# EAGLE design MiniRS485_RJ45-MySens-v1 (EAGLE 8.5.1)
MAPLE-CUx Large Version
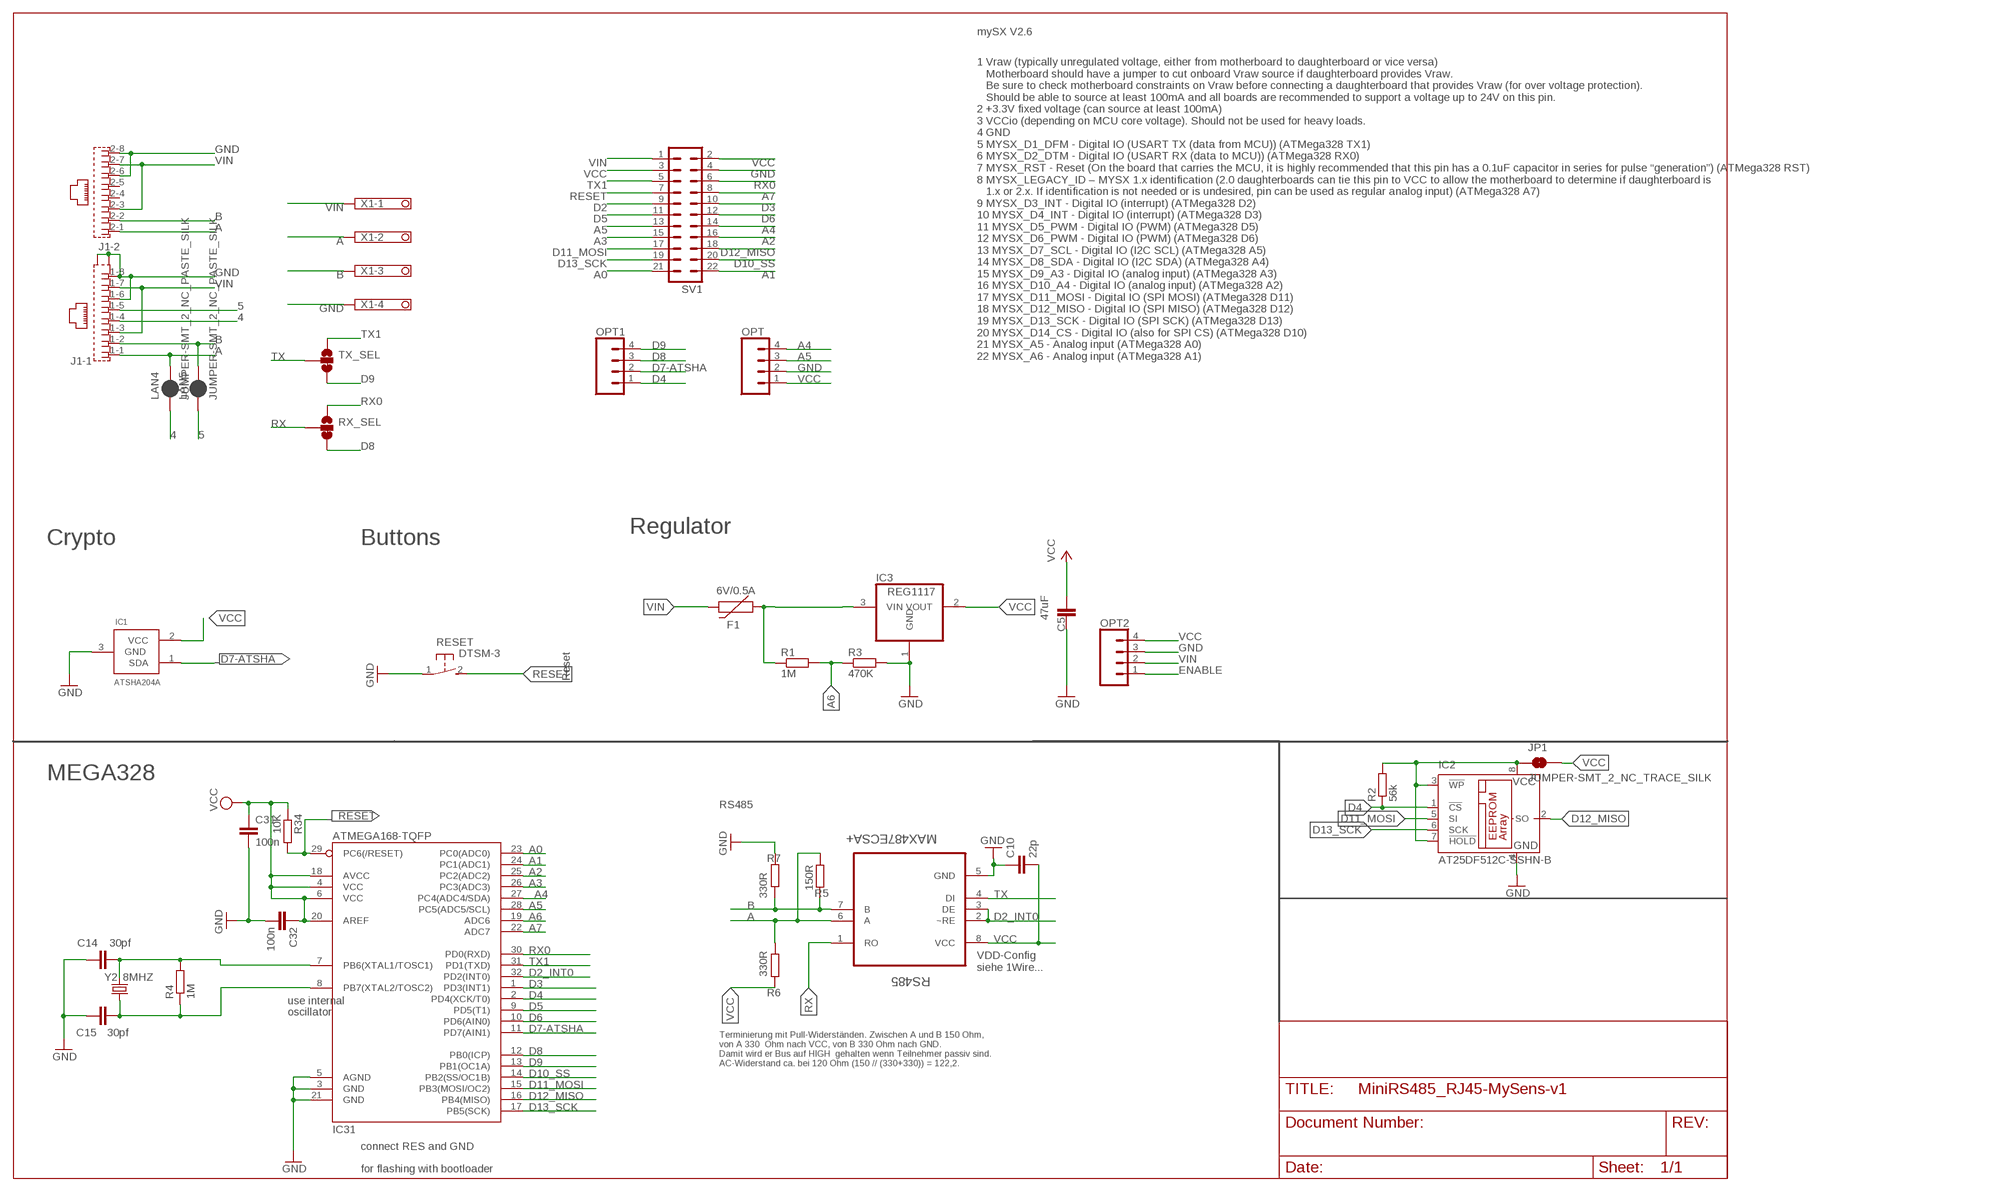
[diagram p0: schematic, sheet 1]

## Parts
C5  47uF  C-EUC1210  [C1210]
C10  22p  C-EUC0805  [C0805]
C14  30pf  C-EUC0805  [C0805]
C15  30pf  C-EUC0805  [C0805]
C31  100n  C-EUC0805  [C0805]
C32  100n  C-EUC0805  [C0805]
F1  6V/0.5A  PPTC_HALF-AMP  [1206]
IC1  ATSHA204A  [SOT23]
IC2  AT25DF512C-SSHN-B  25AA080SN  [SO-08]
IC3  REG1117  [SOT223]
IC31  ATMEGA168-TQFP  [TQFP32-08]
J1  RJ45_2X_NARROW_SHILDPINS_NOCASE  [RJ45_2X_NARROW_SHILDPINS_NOCASE]
JP1  JUMPER-SMT_2_NC_TRACE_SILK  [SMT-JUMPER_2_NC_TRACE_SILK]
LAN4  JUMPER-SMT_2_NC_PASTE_SILK  [SMT-JUMPER_2_NC_PASTE_SILK]
LAN5  JUMPER-SMT_2_NC_PASTE_SILK  [SMT-JUMPER_2_NC_PASTE_SILK]
OPT  CONN_04  [1X04]
OPT1  CONN_04  [1X04]
OPT2  CONN_04  [1X04]
R1  1M  R-EU_M0805  [M0805]
R2  56k  R-EU_M0805  [M0805]
R3  470K  R-EU_R0805  [R0805]
R4  1M  R-EU_M0805  [M0805]
R5  150R  R-EU_R0805  [R0805]
R6  330R  R-EU_R0805  [R0805]
R7  330R  R-EU_R0805  [R0805]
R34  10K  R-EU_R0805  [R0805]
RESET  DTSM-3  [DTSM-3]
RS485  MAX487ECSA+  [SOIC127P600X175-8N]
RX_SEL  JUMPER-SMT_3_1-NC_TRACE_SILK  [SMT-JUMPER_3_1-NC_TRACE_SILK]
SV1  MA11-2  [MA11-2]
TX_SEL  JUMPER-SMT_3_1-NC_TRACE_SILK  [SMT-JUMPER_3_1-NC_TRACE_SILK]
X1  1751264  [1751264]
Y2  8MHZ  CRYSTALTXC-7A  [CRYSTAL-TXC-7A]

## Nets
4: J1.1-4 LAN4.1
5: J1.1-5 LAN5.1
A: J1.1-1 J1.2-1 LAN4.2 R5.1 R6.2 RS485.6(A) X1.2
A0: IC31.23(PC0(ADC0)) SV1.21
A1: IC31.24(PC1(ADC1)) SV1.22
A2: IC31.25(PC2(ADC2)) SV1.16
A3: IC31.26(PC3(ADC3)) SV1.15
A4: IC31.27(PC4(ADC4/SDA)) OPT.4 SV1.14
A5: IC31.28(PC5(ADC5/SCL)) OPT.3 SV1.13
A6: IC31.19(ADC6) R1.2 R3.1
A7: IC31.22(ADC7) SV1.8
B: J1.1-2 J1.2-2 LAN5.2 R5.2 R7.1 RS485.7(B) X1.3
D2: SV1.9
D2_INT0: IC31.32(PD2(INT0)) RS485.2(~RE) RS485.3(DE)
D3: IC31.1(PD3(INT1)) SV1.10
D4: IC2.1(!CS) IC31.2(PD4(XCK/T0)) OPT1.1 R2.1
D5: IC31.9(PD5(T1)) SV1.11
D6: IC31.10(PD6(AIN0)) SV1.12
D7-ATSHA: IC1.1(SDA) IC31.11(PD7(AIN1)) OPT1.2
D8: IC31.12(PB0(ICP)) OPT1.3 RX_SEL.3
D9: IC31.13(PB1(OC1A)) OPT1.4 TX_SEL.3
D10_SS: IC31.14(PB2(SS/OC1B)) SV1.20
D11_MOSI: IC2.5(SI) IC31.15(PB3(MOSI/OC2)) SV1.17
D12_MISO: IC2.2(SO) IC31.16(PB4(MISO)) SV1.18
D13_SCK: IC2.6(SCK) IC31.17(PB5(SCK)) SV1.19
ENABLE: OPT2.1
GND [PWR]: C5.1 C10.1 C14.1 C15.1 C31.2 C32.2 IC1.3(GND) IC2.4(GND) IC3.1(GND) IC31.3(GND) IC31.5(AGND) IC31.21(GND) J1.1-6 J1.1-8 J1.2-6 J1.2-8 J1.G1(-1:S1) J1.G3(-1:S2) OPT2.3 OPT.2 R3.2 R7.2 RESET.1 RS485.5(GND) SV1.4 X1.4
N$3: C14.2 IC31.7(PB6(XTAL1/TOSC1)) R4.2 Y2.P$2
N$19: C15.2 IC31.8(PB7(XTAL2/TOSC2)) R4.1 Y2.P$1
RESET: IC31.29(PC6(/RESET)) R34.2 RESET.2 SV1.7
RX: RS485.1(RO) RX_SEL.2
RX0: IC31.30(PD0(RXD)) RX_SEL.1 SV1.6
TX: RS485.4(DI) TX_SEL.2
TX1: IC31.31(PD1(TXD)) SV1.5 TX_SEL.1
VCC [PWR]: C5.2 C10.2 C31.1 C32.1 IC1.2(VCC) IC3.2(VOUT) IC31.4(VCC) IC31.6(VCC) IC31.18(AVCC) IC31.20(AREF) JP1.2 OPT2.4 OPT.1 R6.1 R34.1 RS485.8(VCC) SV1.2 SV1.3
VCC1 [PWR]: IC2.3(!WP) IC2.7(!HOLD) IC2.8(VCC) JP1.1 R2.2
VIN [PWR]: F1.2 J1.1-3 J1.1-7 J1.2-3 J1.2-7 OPT2.2 SV1.1 X1.1
VIN-FUSED [PWR]: F1.1 IC3.3(VIN) R1.1
Unconnected: J1.2-4 J1.2-5

## Notes on the sheet
- mySX V2.6
- 1 Vraw (typically unregulated voltage, either from motherboard to daughterboard or vice versa)
     Motherboard should have a jumper to cut onboard Vraw source if daughterboard provides Vraw. 
     Be sure to check motherboard constraints on Vraw before connecting a daughterboard that provides Vraw (for over voltage protection). 
     Should be able to source at least 100mA and all boards are recommended to support a voltage up to 24V on this pin.
  2 +3.3V fixed voltage (can source at least 100mA)
  3 VCCio (depending on MCU core voltage). Should not be used for heavy loads.
  4 GND
  5 MYSX_D1_DFM - Digital IO (USART TX (data from MCU)) (ATMega328 TX1)
  6 MYSX_D2_DTM - Digital IO (USART RX (data to MCU)) (ATMega328 RX0)
  7 MYSX_RST - Reset (On the board that carries the MCU, it is highly recommended that this pin has a 0.1uF capacitor in series for pulse “generation”) (ATMega328 RST)
  8 MYSX_LEGACY_ID – MYSX 1.x identification (2.0 daughterboards can tie this pin to VCC to allow the motherboard to determine if daughterboard is 
     1.x or 2.x. If identification is not needed or is undesired, pin can be used as regular analog input) (ATMega328 A7)
  9 MYSX_D3_INT - Digital IO (interrupt) (ATMega328 D2)
  10 MYSX_D4_INT - Digital IO (interrupt) (ATMega328 D3)
  11 MYSX_D5_PWM - Digital IO (PWM) (ATMega328 D5)
  12 MYSX_D6_PWM - Digital IO (PWM) (ATMega328 D6)
  13 MYSX_D7_SCL - Digital IO (I2C SCL) (ATMega328 A5)
  14 MYSX_D8_SDA - Digital IO (I2C SDA) (ATMega328 A4)
  15 MYSX_D9_A3 - Digital IO (analog input) (ATMega328 A3)
  16 MYSX_D10_A4 - Digital IO (analog input) (ATMega328 A2)
  17 MYSX_D11_MOSI - Digital IO (SPI MOSI) (ATMega328 D11)
  18 MYSX_D12_MISO - Digital IO (SPI MISO) (ATMega328 D12)
  19 MYSX_D13_SCK - Digital IO (SPI SCK) (ATMega328 D13)
  20 MYSX_D14_CS - Digital IO (also for SPI CS) (ATMega328 D10)
  21 MYSX_A5 - Analog input (ATMega328 A0)
  22 MYSX_A6 - Analog input (ATMega328 A1)
- Regulator
- Crypto | Buttons
- Reset
- MEGA328
- RS485
- VDD-Config
  siehe 1Wire...
- use internal
- oscillator
- Terminierung mit Pull-Widerständen. Zwischen A und B 150 Ohm,
  von A 330  Ohm nach VCC, von B 330 Ohm nach GND. 
  Damit wird er Bus auf HIGH  gehalten wenn Teilnehmer passiv sind.
  AC-Widerstand ca. bei 120 Ohm (150 // (330+330)) = 122,2.
- connect RES and GND
- for flashing with bootloader

## Library data of the parts
C5 C10 C31 C32 = rcl:C-EU: CAPACITOR, European symbol; SPICEPREFIX: C
C14 C15 = resistor:C-EU: CAPACITOR, European symbol
F1 = SparkFun-Fuses:PPTC: Resettable Fuse PPTC Resettable Fuse. Really a sort of resistor with a polymeric positive temperature coefficient whose resistance increases dramatically with an increase in temperature. When heated by the power passing through the resistance rises causing the current to be limited, protecting the circuit. This is achieved by the transition of the polymer from a crystalline to an amorphous state where the conductive carbon separates breaking the conductive pathways found in the cool crystalline structure. When a PPTC cools back down it resumes conducting letting the circuit turn back on. SparkFun Products: SparkFun RedBoard - Programmed with Arduino <https://www.sparkfun.com/products/12757> Pro Micro - 5V/16MHz <https://www.sparkfun.com/products/12640> Arduino Pro 328 - 5V/16MHz <https://www.sparkfun.com/products/10915> MP3 Trigger <https://www.sparkfun.com/products/13720>; PROD_ID: RES-08585
IC1 = Sensor:ATSHA204A
IC2 = microchip:25*: Serial EEPROM 4K/ 8K , SPI bus; MF: MICROCHIP; MPN: 25AA080/SN; OC_FARNELL: 1816072; OC_NEWARK: 92C7351
IC3 = burr-brown:REG1117: 800mA and 1A Low Dropout (LDO) Positive Regulator 1.8V, 2.5V, 2.85V, 3.3V, 5V, and Adj; MPN: REG1117; OC_FARNELL: 1097566; OC_NEWARK: 14P6981
IC31 = atmel:ATMEGA168: Atmel Atmega 168/328/328P
J1 = RJ45:RJ45_2X_NARROW_SHILDPINS_NOCASE: RJ45 connector
JP1 = SparkFun-Jumpers:JUMPER-SMT_2_NC_TRACE: Normally closed trace jumper This jumper has a trace between two pads so it's normally closed (NC). Use a razor knife to open the connection. For best results follow the IPC guidelines for cutting traces: Cutout at least 0.063 mm (0.005 in). Remove all loose material to clean up the cut area. Seal the cut with an approved epoxy. Reapply solder to reclose the connection.
LAN4 LAN5 = SparkFun-Jumpers:JUMPER-SMT_2_NC_PASTE: Normally closed solder jumper This jumper has an aperture in the stencil to allow solder paste to bridge the split in the wire so it's normally closed (NC). Wick off the solder to open the connection. Reapply solder to reclose the connection.
OPT OPT1 OPT2 = SparkFun-Connectors:CONN_04: Multi connection point. Often used as Generic Header-pin footprint for 0.1 inch spaced/style header connections On any of the 0.1 inch spaced packages, you can populate with these: Break Away Headers - Straight <https://www.sparkfun.com/products/116> (PRT-00116) Break Away Male Headers - Right Angle <https://www.sparkfun.com/products/553> (PRT-00553) Female Headers <https://www.sparkfun.com/products/115> (PRT-00115) Break Away Headers - Machine Pin <https://www.sparkfun.com/products/117> (PRT-00117) Break Away Female Headers - Swiss Machine Pin <https://www.sparkfun.com/products/743> (PRT-00743) For SCREWTERMINALS and SPRING TERMINALS visit here: Screw Terimnals on SparkFun.com <https://www.sparkfun.com/search/results?term=Screw+Terminals> (5mm/3.5mm/2.54mm spacing) This device is also useful as a general connection point to wire up your design to another part of your project. Our various solder wires solder well into these plated through hole pads. Hook-Up Wire - Assortment (Stranded, 22 AWG) <https://www.sparkfun.com/products/11375> (PRT-11375) Hook-Up Wire - Assortment (Solid Core, 22 AWG) <https://www.sparkfun.com/products/11367> (PRT-11367) View the entire wire category on our website here <https://www.sparkfun.com/categories/141> Special notes: Molex polarized connector foot print use with SKU : PRT-08231 with associated crimp pins and housings. 1MM SMD Version SKU: PRT-10208; PROD_ID: CONN-09696
R1 R3-R7 R34 = rcl:R-EU_: RESISTOR, European symbol; SPICEPREFIX: R
R2 = resistor:R-EU_: RESISTOR, European symbol
RESET = mechanics:DTSM-3: Diptronics SMD button 6x3.5 mm
RS485 = Maxim_By_element14_Batch_1:MAX487ECSA+: Low-Power, Slew-Rate-Limited RS-485/RS-422 Transceivers; MPN: MAX487ECSA+; OC_FARNELL: 9724532; OC_NEWARK: 68K4803; PACKAGE: SOIC-8; SUPPLIER: Maxim
RX_SEL TX_SEL = SparkFun-Jumpers:JUMPER-SMT_3_1-NC_TRACE: Normally closed trace jumper (1 of 2 connections) This jumper has a trace between two pads so it's normally closed (NC). The other connection is normally open (NO). Use a razor knife to open the connection. For best results follow the IPC guidelines for cutting traces: Cutout at least 0.063 mm (0.005 in). Remove all loose material to clean up the cut area. Seal the cut with an approved epoxy. Reapply solder to reclose the connection, or to close the NO connection.
SV1 = con-Pinheader:MA11-2: PIN HEADER; OC_FARNELL: unknown; OC_NEWARK: unknown
X1 = con-phoenix-350:1751264: MKDS 1/ 4-3,5 Printklemme Nennstrom: 10 A Bemessungsspannung: 160 V Raster: 3,5 mm Polzahl: 4 Montageart: Löten Anschlussart: Schraubanschluss Anschlussrichtung vom Leiter zur Platine: 0° Source: http://eshop.phoenixcontact.com .. 1751264.pdf; MPN: 1751264; OC_FARNELL: unknown; OC_NEWARK: 10R0934
Y2 = SparkFun-FreqCtrl:CRYSTAL: Various standard crystals. Proven footprints.

## Net classes
0 default: width 0.254 mm, clearance 0.205 mm
1 PWR: width 0.406 mm, clearance 0.205 mm to class 0, clearance 0.205 mm

## Board
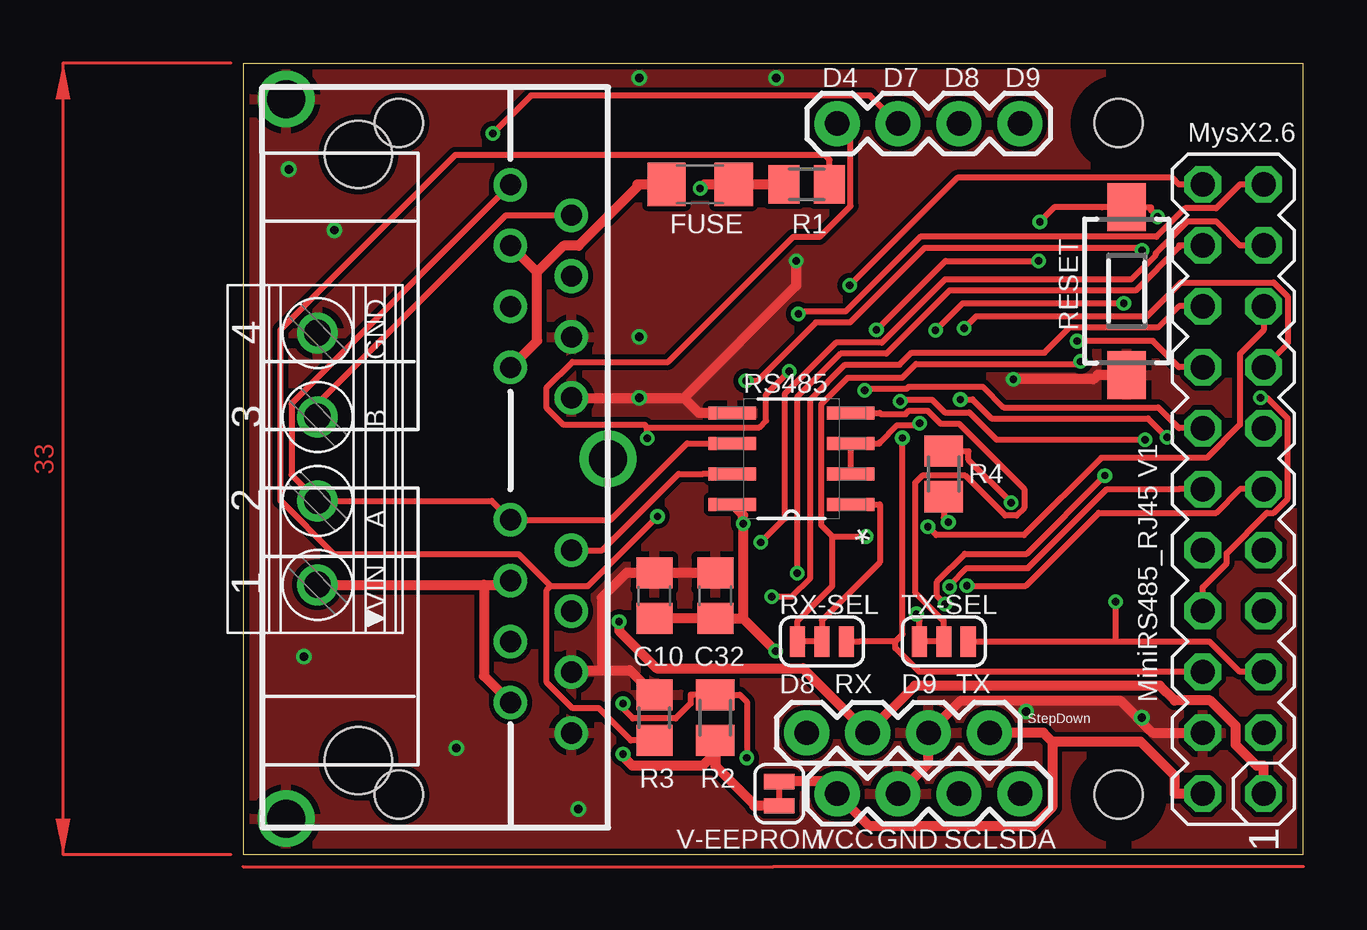
[diagram p1: board, top side]
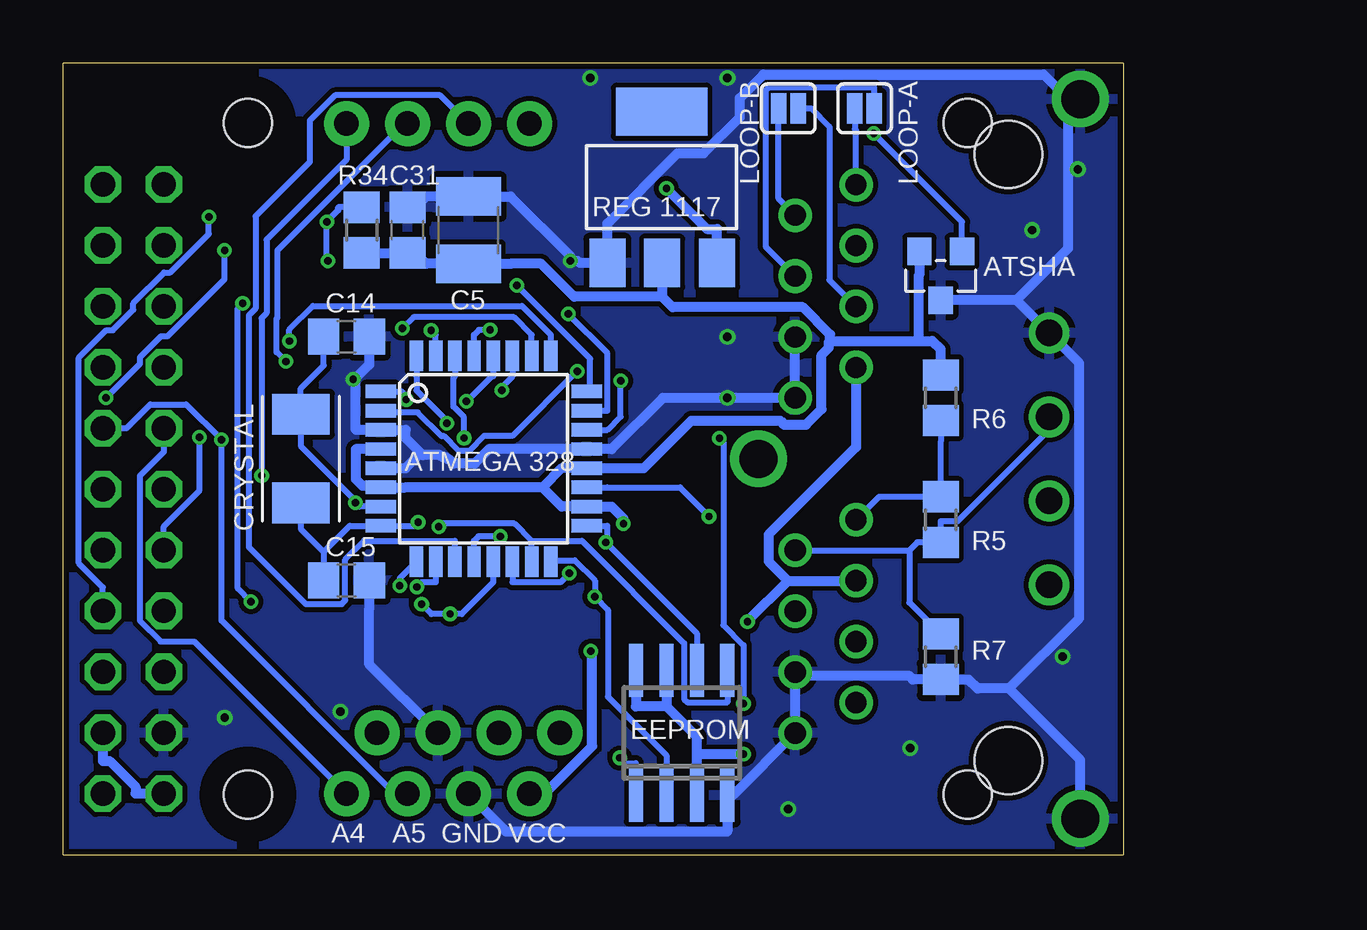
[diagram p2: board, bottom side, seen from below]

Size 44.2 x 33 mm. Coordinates in mm from the lower left corner, seen from the top.
Outline: 44.2,0 0,0 0,33 44.2,33 44.2,0
Copper layers (1*16): Top 0.035mm / dielectric 1.5mm / Bottom 0.035mm
Design rules "SeeedStudio_2layer_DRU_no_angle_20140221 *": minimum track width 6mil, minimum drill 12mil, track to track 4mil, track to pad 4mil, pad to pad 4mil, via to via 4mil, smd to smd 0mil, copper to edge 10mil, drill to drill 10mil, minimum pad ring 10mil, minimum via ring 6mil, stop-mask expansion 2mil, vias tented up to drill 100mil, thermal gap 10mil
Holes 2 mm at 36.5,30.5 36.5,2.5 6.5,2.5 6.5,30.5
tRestrict: area 34.8,0.8 to 38.2,4.2; area 34.8,28.8 to 38.2,32.2
bRestrict: area 34.8,28.8 to 38.2,32.2; area 34.8,0.8 to 38.2,4.2

### Footprints (pad centres in the part's own frame; a part is rotated, then mirrored left to right if it is on the bottom)
C1210 = smd 1.6 x 2.7: 1 -1.4,0; 2 1.4,0
C0805 = smd 1.3 x 1.5: 1 -0.95,0; 2 0.95,0
1206 = smd 1.6 x 1.8: 1 -1.4,0; 2 1.4,0
SOT23 = smd 1.016 x 1.143: 1 -0.889,-1.016; 2 0.889,-1.016; 3 0,1.016
SO-08 = smd 0.6 x 2.2: 1 -1.905,-2.6; 2 -0.635,-2.6; 3 0.635,-2.6; 4 1.905,-2.6; 5 1.905,2.6; 6 0.635,2.6; 7 -0.635,2.6; 8 -1.905,2.6
SOT223 = smd 1.499 x 2.007: 1 -2.261,-3.15; 2 0.025,-3.15; 3 2.311,-3.15 | smd 3.81 x 2.007: 4 0,3.15
TQFP32-08 = smd 1.27 x 0.559: 1 -4.293,2.8; 2 -4.293,2; 3 -4.293,1.2; 4 -4.293,0.4; 5 -4.293,-0.4; 6 -4.293,-1.2; 7 -4.293,-2; 8 -4.293,-2.8; 17 4.293,-2.8; 18 4.293,-2; 19 4.293,-1.2; 20 4.293,-0.4; 21 4.293,0.4; 22 4.293,1.2; 23 4.293,2; 24 4.293,2.8 | smd 0.559 x 1.27: 9 -2.8,-4.293; 10 -2,-4.293; 11 -1.2,-4.293; 12 -0.4,-4.293; 13 0.4,-4.293; 14 1.2,-4.293; 15 2,-4.293; 16 2.8,-4.293; 25 2.8,4.293; 26 2,4.293; 27 1.2,4.293; 28 0.4,4.293; 29 -0.4,4.293; 30 -1.2,4.293; 31 -2,4.293; 32 -2.8,4.293
RJ45_2X_NARROW_SHILDPINS_NOCASE = drill 0.889: 1-1 -11.43,6.35; 1-2 -10.16,8.89; 1-3 -8.89,6.35; 1-4 -7.62,8.89; 1-5 -6.35,6.35; 1-6 -5.08,8.89; 1-7 -3.81,6.35; 1-8 -2.54,8.89; 2-1 2.54,6.35; 2-2 3.81,8.89; 2-3 5.08,6.35; 2-4 6.35,8.89; 2-5 7.62,6.35; 2-6 8.89,8.89; 2-7 10.16,6.35; 2-8 11.43,8.89 | drill 1.575 pad 2.184: G1 -15,-3; G2 0,10.414; G3 15,-3 | hole 2.8: -12.7,0; 12.573,0
SMT-JUMPER_2_NC_TRACE_SILK = smd 0.635 x 1.27: 1 -0.508,0; 2 0.508,0
SMT-JUMPER_2_NC_PASTE_SILK = smd 0.635 x 1.27: 1 -0.406,0; 2 0.406,0
1X04 = drill 1.016 pad 1.88: 1 0,0; 2 2.54,0; 3 5.08,0; 4 7.62,0
M0805 = smd 1.3 x 1.6: 1 -0.95,0; 2 0.95,0
R0805 = smd 1.3 x 1.5: 1 -0.95,0; 2 0.95,0
DTSM-3 = smd 2 x 1.6: 1 -3.494,0; 2 3.494,0
SOIC127P600X175-8N = smd 1.981 x 0.533: 1 -2.464,1.905; 2 -2.464,0.635; 3 -2.464,-0.635; 4 -2.464,-1.905; 5 2.464,-1.905; 6 2.464,-0.635; 7 2.464,0.635; 8 2.464,1.905
SMT-JUMPER_3_1-NC_TRACE_SILK = smd 0.635 x 1.27: 1 -1.016,0; 2 0,0; 3 1.016,0
MA11-2 = drill 1.016 octagon: 1 -12.7,-1.27; 2 -12.7,1.27; 3 -10.16,-1.27; 4 -10.16,1.27; 5 -7.62,-1.27; 6 -7.62,1.27; 7 -5.08,-1.27; 8 -5.08,1.27; 9 -2.54,-1.27; 10 -2.54,1.27; 11 0,-1.27; 12 0,1.27; 13 2.54,-1.27; 14 2.54,1.27; 15 5.08,-1.27; 16 5.08,1.27; 17 7.62,-1.27; 18 7.62,1.27; 19 10.16,-1.27; 20 10.16,1.27; 21 12.7,-1.27; 22 12.7,1.27
1751264 = drill 1.1 pad 1.7: 1 -5.25,-0.1; 2 -1.75,-0.1; 3 1.75,-0.1; 4 5.25,-0.1
CRYSTAL-TXC-7A = smd 1.7 x 2.4: P$1 1.85,0; P$2 -1.85,0

### Placement (x,y rotation side)
C5  27.3,26.04 270 bottom
C10  17.14,10.79 270 top
C14  32.38,21.59 180 bottom
C15  32.38,11.43 180 bottom
C31  29.84,26.04 90 bottom
C32  19.68,10.79 90 top
F1  19.05,27.94 180 top
IC1  7.62,24.13 180 bottom
IC2  18.41,5.08 0 bottom
IC3  19.25,27.82 0 bottom
IC31  26.67,16.51 0 bottom
J1  4.8,16.5 270 top
JP1  22.35,2.54 90 top
LAN4  10.79,31.11 180 bottom
LAN5  13.97,31.11 180 bottom
OPT  24.77,2.54 0 top
OPT1  24.77,30.48 0 top
OPT2  23.5,5.08 0 top
R1  23.5,27.94 0 top
R2  19.68,5.71 270 top
R3  17.14,5.71 90 top
R4  29.21,15.88 90 top
R5  7.62,13.97 270 bottom
R6  7.62,19.05 270 bottom
R7  7.62,8.26 270 bottom
R34  31.75,26.04 90 bottom
RESET  36.83,23.5 90 top
RS485  22.86,16.51 180 top
RX_SEL  24.13,8.89 180 top
SV1  41.27,15.24 90 top
TX_SEL  29.21,8.89 180 top
X1  3,16.5 90 top
Y2  34.29,16.51 270 bottom

### Tracks (layer width: path | path; a pad name or v marks a point on that pad's centre or on a via)
4
  Bottom 0.254: LAN4.1 10.39,31.98 14.79,31.98 14.92,31.85 14.92,25.35 J1.1-4
5
  Bottom 0.254: LAN5.1 13.02,31.11 12.26,30.36 12.26,23.96 J1.1-5
A
  Top 0.254: J1.1-1 2.02,18.8 2.02,15.83 X1.2 10.36,14.75 J1.2-1 15.32,13.96 18.51,17.14 RS485.6
  Bottom 0.254: LAN4.2 11.2,30.25 11.15,30.2 J1.1-1 | R6.2 7.62,17.22 R5.1 10.19,14.92 J1.2-1
A0  (via drill 0.3 pad 0.61)
  Top 0.254: v23.15,22.54 23.25,22.64 25.11,22.64 28.23,25.76 38.07,25.76 39.26,26.95 40.56,26.95 41.55,27.94 SV1.21
  Bottom 0.254: v23.15,22.54 21.51,20.91 21.51,18.51 IC31.23
A1  (via drill 0.3 pad 0.61)
  Top 0.254: v25.28,23.73 29.77,28.22 38.74,28.22 39.01,27.94 SV1.22
  Bottom 0.254: IC31.24 22.23,19.45 22.23,20.68 v25.28,23.73
A2  (via drill 0.3 pad 0.61)
  Top 0.254: SV1.16 39.01,20.32 37.92,21.41 v34.77,21.41
  Bottom 0.254: IC31.25 23.87,21.67 25.08,22.87 33.78,22.87 34.77,21.89 v34.77,21.41
A3  (via drill 0.3 pad 0.61)
  Top 0.254: v30.06,21.95 30.56,22.45 37.69,22.45 39.1,23.86 42.95,23.86 43.54,23.27 43.54,21.32 SV1.15
  Bottom 0.254: v30.06,21.95 29.6,22.41 25.41,22.41 24.67,21.67 IC31.26
A4  (via drill 0.3 pad 0.61)
  Top 0.254: v25.91,19.36 25.98,19.43 27.67,19.43 27.75,19.51 30.84,19.51 31.7,18.65 38.15,18.65 39.01,17.78 SV1.14
  Bottom 0.254: v25.91,19.36 25.91,19.5 25.47,19.94 IC31.27 | SV1.14 40.01,16.79 41,15.8 41,9.75 40.14,8.89 38.73,8.89 OPT.4
A5  (via drill 0.3 pad 0.61)
  Top 0.254: v27.39,18.9 27.46,18.97 28.72,18.97 29.25,18.44 30.27,18.44 31.41,17.3 v37.6,17.3
  Bottom 0.254: SV1.13 41.55,17.78 40.56,18.77 39.07,18.77 v37.6,17.3 37.6,9.77 30.37,2.54 OPT.3 | v27.39,18.9 26.35,19.94 26.27,19.94 IC31.28
A6  (via drill 0.3 pad 0.61)
  Top 0.254: 12.82,11.2 11.5,12.53 3.8,12.53 1.56,14.76 1.56,21.88 8.85,29.17 24.24,29.17 24.45,28.97 R1.2 | 12.82,11.2 12.66,11.04 12.66,7.18 13.74,6.1 14.83,6.1 16.17,4.76 R3.1 | 12.82,11.2 14.38,11.2 v17.28,14.1
  Bottom 0.254: v17.28,14.1 18.48,15.31 21.51,15.31 IC31.19
A7  (via drill 0.3 pad 0.61)
  Top 0.254: v37.47,25.2 37.38,25.29 28.4,25.29 25.3,22.18 23.88,22.18 21.45,19.75 v20.96,19.75 | v42.41,19.05 42.68,19.05 43.54,18.19 43.54,14.83 42.95,14.25 42.68,14.25 41,12.56 41,12.14 40.01,11.15 SV1.8
  Bottom 0.254: v42.41,19.05 41,20.46 41,20.74 40.12,21.61 39.85,21.61 37.47,23.99 v37.47,25.2 | v20.96,19.75 20.96,18.26 21.51,17.71 IC31.22
B
  Top 0.254: J1.2-2 14.97,12.69 18.15,15.88 19.18,15.88 RS485.7 | X1.3 3.1,18.81 10.95,26.66 J1.1-2
  Bottom 0.254: X1.3 3.1,17.71 6.92,13.9 7.62,13.9 R5.2 8.6,13.02 8.93,12.69 | 8.93,12.69 8.93,10.51 R7.1 | J1.2-2 8.93,12.69 | J1.1-2 14.38,27.35 LAN5.2
D2_INT0  (via drill 0.3 pad 0.61)
  Top 0.254: v28.2,17.98 28.12,17.9 27.26,17.9 26.54,17.19 26.54,17.14 RS485.3 RS485.2
  Bottom 0.254: v28.2,17.98 28.2,18.09 29.47,19.36 29.47,19.94 IC31.32
D3  (via drill 0.3 pad 0.61)
  Top 0.254: v29.9,18.98 30.41,18.98 31.19,18.19 37.72,18.19 v38.51,17.4
  Bottom 0.254: v38.51,17.4 38.51,15.18 40.01,13.69 SV1.10 | v29.9,18.98 29.9,19.11 30.1,19.31 IC31.1
D4  (via drill 0.3 pad 0.61)
  Top 0.254: 16.84,17.81 21.52,17.81 21.8,18.09 21.8,19.18 v22.77,20.15 | v16.84,17.36 16.84,17.81 | 16.84,17.81 16.75,17.91 13.36,17.91 12.66,18.61 12.66,19.47 13.72,20.54 17.72,20.54 22.94,25.76 24.04,25.76 25.33,27.04 25.33,29.92 OPT1.1 | v21,4.04 21,6.38 20.71,6.67 R2.1 19.17,6.67 18.66,6.67 18.66,6.31 18.03,5.68 16.25,5.68 15.84,6.09 v15.84,6.3
  Bottom 0.254: v16.84,17.36 16.68,17.19 16.68,9.57 15.84,8.73 v15.84,6.3 | IC2.1 20.32,3.81 20.77,3.81 v21,4.04 | v22.77,20.15 25.47,17.46 26.65,17.46 27.27,16.84 27.71,16.84 28.32,17.45 28.42,17.45 29.42,18.44 30.89,18.44 IC31.2
D5  (via drill 0.3 pad 0.61)
  Top 0.254: v30.17,11.21 32.63,11.21 35.66,14.25 40.56,14.25 41.55,15.24 SV1.11
  Bottom 0.254: IC31.9 30.17,11.52 v30.17,11.21
D6  (via drill 0.3 pad 0.61)
  Top 0.254: v29.46,11.16 29.46,11.25 30.16,11.95 32.72,11.95 36.01,15.24 39.01,15.24 SV1.12
  Bottom 0.254: v29.46,11.16 29.27,11.35 28.67,11.35 IC31.10
D7-ATSHA  (via drill 0.3 pad 0.61)
  Top 0.254: OPT1.2 26.14,31.65 12,31.65 v10.41,30.06
  Bottom 0.254: IC1.1 6.73,26.39 v10.41,30.06 | OPT1.2 28.48,31.65 32.87,31.65 33.91,30.6 33.91,28.88 36.18,26.61 36.18,22.76 36.46,22.48 36.46,12.82 34.09,10.45 32.59,10.45 32.44,10.6 32.44,12.3 31.66,13.08 27.87,13.08 IC31.11
D8  (via drill 0.3 pad 0.61)
  Top 0.254: 24.56,13.27 24.1,13.73 24.1,18.78 25.21,19.89 27.48,19.89 28.05,20.46 34.82,20.46 v34.92,20.56 | 24.56,13.27 24.56,11.2 23.11,9.75 RX_SEL.3 | 24.56,13.27 v25.97,13.27
  Bottom 0.254: v34.92,20.56 35.3,20.94 35.3,22.34 35.26,22.38 35.26,25.2 29.98,30.48 OPT1.3 | IC31.12 27.07,13.08 26.88,13.27 v25.97,13.27
D9  (via drill 0.3 pad 0.61)
  Top 0.254: v29.26,10.45 28.92,10.78 28.92,11.38 30.08,12.54 32.67,12.54 v35.92,15.8 | TX_SEL.3 28.19,9.75 28.07,9.88 v28.07,10.04
  Bottom 0.254: OPT1.4 32.38,28.97 35.72,25.64 35.72,22.57 35.92,22.37 v35.92,15.8 | v29.26,10.45 28.85,10.04 v28.07,10.04 27.59,10.04 26.27,11.35 IC31.13
D10_SS  (via drill 0.3 pad 0.61)
  Top 0.254: 29.45,23.52 37.21,23.52 39.01,25.32 39.01,25.4 SV1.20 | 29.45,23.52 | 29.45,23.52 26.81,20.88 24.9,20.88 23.1,19.07 v23.1,11.73
  Bottom 0.254: IC31.14 25.47,11.35 23.48,11.35 v23.1,11.73
D11_MOSI  (via drill 0.3 pad 0.61)
  Top 0.254: v28.55,13.68 28.9,13.32 32.55,13.32 35.77,16.54 40.17,16.54 41.55,17.93 41.55,20.88 42.55,21.87 SV1.17
  Bottom 0.254: 24.67,13.08 25.39,13.8 28.42,13.8 v28.55,13.68 | IC2.5 16.51,6.35 18.18,6.35 18.31,6.48 18.31,8.82 22.57,13.08 24.67,13.08 | 24.67,13.08 24.67,12.97 IC31.15
D12_MISO  (via drill 0.3 pad 0.61)
  Top 0.254: v22.04,10.76 22.88,10.76 23.64,11.52 23.64,18.97 25.09,20.42 27.36,20.42 27.86,20.92 33.41,20.92 34.47,21.99 38.14,21.99 39.01,22.86 SV1.18
  Bottom 0.254: IC2.2 19.05,4.14 21.49,6.58 21.49,10.21 v22.04,10.76 22.04,11.43 22.87,12.27 23.82,12.27 IC31.16
D13_SCK  (via drill 0.3 pad 0.61)
  Top 0.254: 26.62,21.34 29.26,23.98 37.01,23.98 38.04,25 38.04,25.08 39.35,26.39 40.56,26.39 41.55,25.4 SV1.19 | 26.62,21.34 | 26.62,21.34 24.71,21.34 22.57,19.2 22.57,14.01 v21.57,13.02
  Bottom 0.254: IC31.17 21.51,13.71 21.51,13.08 v21.57,13.02 17.78,9.22 IC2.6
GND  (via drill 0.3 pad 0.61, 0.35)
  Top 0.406: 14.96,7.69 16.12,7.69 R3.2 | J1.2-6 13.77,7.69 14.96,7.69 | 14.96,7.69 14.96,10.72 15.99,11.74 C10.1 C32.2 | v32.11,19.82 35.44,19.82 35.62,20 RESET.1 | 18.37,19.04 19,18.41 RS485.5 | J1.1-8 18.37,19.04 | v23.06,24.75 23.06,23.72 18.37,19.04 | SV1.4 37.91,5.08 36.56,6.43 29.92,6.43 OPT2.3 28.57,3.81 OPT.2
  Bottom 0.406: 29.29,16.74 29.21,16.66 28.47,16.66 28.38,16.57 28.25,16.57 28.17,16.49 28.11,16.49 27.93,16.3 27.04,16.3 26.44,16.91 23.42,16.91 IC31.21 21.33,16.91 19.2,19.04 J1.1-8 J1.1-6 | OPT.2 25.74,0.97 16.51,0.97 IC2.4 16.28,2.48 J1.2-8 13.69,7.45 | 2.31,31.5 J1.G1 | 2.31,31.5 3.33,32.52 15.01,32.52 16,31.54 16,30.74 17.5,29.24 18.59,29.24 21.52,26.32 IC3.1 22.67,24.67 22.76,24.75 v23.06,24.75 23.06,24.94 25.55,27.43 C5.1 29.06,27.43 29.51,26.98 C31.2 | 2.31,31.5 2.31,25.27 4.46,23.11 | 4.46,23.11 IC1.3 | 4.46,23.11 X1.4 1.84,20.49 1.84,9.86 4.77,6.92 | 32.01,19.82 32.01,19.86 31.43,20.43 C14.1 | 32.01,19.82 32.01,17.71 IC31.3 29.92,17.71 29.92,17.36 29.29,16.74 | 32.01,19.82 v32.11,19.82 | 29.29,16.74 29.92,16.11 IC31.5 | OPT2.3 31.43,7.94 31.43,10.27 C15.1 | 13.69,7.45 J1.2-6 | 13.69,7.45 8.92,7.45 8.78,7.3 R7.2 6.46,7.3 6.08,6.92 4.77,6.92 | J1.G3 1.8,3.95 4.77,6.92
  other vias: 1.91,28.57 3.81,26.04 2.54,8.26 8.89,4.45 13.97,1.91 16.51,21.59 16.51,19.05 16.51,32.38 22.23,32.38 37.47,5.71 32.64,5.97
  pour Top: 0,0 0,33.02 44.45,33.02 44.45,0
  pour Bottom: 0,0 0,33.02 44.45,33.02 44.45,0
N$3  (via drill 0.3 pad 0.61)
  Top 0.254: v32.02,14.68 30.24,16.46 30.24,16.82 R4.2
  Bottom 0.254: IC31.7 31.86,14.51 v32.02,14.68 32.02,14.77 34.29,17.04 34.29,17.28 Y2.P$2 34.29,19.44 33.34,20.39 C14.2
N$19  (via drill 0.3 pad 0.61)
  Top 0.254: v29.4,13.86 29.22,14.05 29.21,14.05 R4.1
  Bottom 0.254: v29.4,13.86 29.55,13.71 IC31.8 32.25,13.71 33.34,12.63 | 33.34,12.63 C15.2 | 33.34,12.63 34.29,13.58 Y2.P$1
RESET  (via drill 0.3 pad 0.61)
  Top 0.254: v26.4,21.87 29.28,24.75 v33.16,24.75 | v33.21,26.38 33.82,26.99 35.8,26.99 RESET.2 37.86,26.99 37.86,26.86 v38.13,26.59
  Bottom 0.254: v33.16,24.75 33.21,24.81 v33.21,26.38 32.73,26.87 32.73,26.98 R34.2 | v26.4,21.87 26.86,21.87 27.07,21.67 IC31.29 | SV1.7 42.55,11.15 43.54,12.14 43.54,20.73 42.4,21.87 42.13,21.87 41.27,22.72 41.27,22.99 40,24.27 39.73,24.27 38.13,25.87 v38.13,26.59
RX
  Top 0.254: RX_SEL.2 24.13,9.77 26.54,12.18 26.54,14.61 RS485.1
RX0  (via drill 0.3 pad 0.61)
  Top 0.254: 27.19,8.89 27.49,9.18 v27.49,17.37 | 27.19,8.89 25.69,8.89 RX_SEL.1 | 27.19,8.89 27.19,8.62 28.19,7.62 39.01,7.62 SV1.6
  Bottom 0.254: v27.49,17.37 27.49,18.24 27.92,18.68 27.92,19.89 27.87,19.94 IC31.30
TX
  Top 0.254: RS485.4 26.54,18.41 26.59,18.36 27.61,18.36 27.76,18.51 28.53,18.51 29.07,17.97 29.84,17.97 32.56,15.25 32.56,14.45 32.24,14.14 31.77,14.14 30.1,15.81 28.32,15.81 28.01,15.5 28.01,10.94 29.2,9.75 29.21,9.75 TX_SEL.2
TX1  (via drill 0.3 pad 0.61)
  Top 0.254: v36.71,22.98 29.99,22.98 v28.86,21.86 | 36.37,8.89 40.28,8.89 41.55,7.62 SV1.5 | TX_SEL.1 36.37,8.89 | 36.37,8.89 v36.37,10.54
  Bottom 0.254: v28.86,21.86 28.67,21.67 IC31.31 | v36.37,10.54 36.92,11.09 36.92,22.78 v36.71,22.98
VCC  (via drill 0.3 pad 0.61)
  Top 0.406: v22.2,8.49 20.84,9.85 | 20.84,9.85 C32.1 C10.2 | 20.84,9.85 v20.84,13.79 20.84,14.16 RS485.8 | JP1.2 24.26,3.05 OPT.1 26.12,1.19 32.95,1.19 33.73,1.98 33.73,4.71 | 33.73,4.71 33.36,5.08 OPT2.4 | 33.73,4.71 37.41,4.71 38.84,3.29 38.84,2.54 SV1.2
  Bottom 0.406: OPT.1 24.12,2.54 22.15,4.52 22.15,8.43 v22.2,8.49 | v20.84,13.79 20.84,14.02 21.33,14.51 IC31.18 23.42,14.51 24.22,15.31 | 19.23,23.26 22.9,23.26 24.27,24.64 25.55,24.64 C5.2 28.18,24.64 29.06,24.64 29.51,25.09 C31.1 R34.1 | IC3.2 19.23,23.26 | 12.23,21.42 12.23,21.69 13.37,22.83 18.8,22.83 19.23,23.26 | 12.23,21.42 8.54,21.42 | 12.23,21.42 12.29,21.36 12.29,21.14 12.58,20.84 12.58,18.58 13.23,17.93 14.15,17.93 14.3,18.09 18.01,18.09 19.99,16.11 IC31.20 23.42,16.11 24.22,15.31 | 8.54,21.42 7.98,21.42 7.62,21.06 R6.1 | 8.54,21.42 8.54,24.14 8.51,24.17 IC1.2 | SV1.2 41.17,2.54 41.17,2.83 42.26,3.91 42.55,3.91 SV1.3 | 24.22,15.31 29.92,15.31 IC31.6 31.04,15.39 31.73,15.39 32.01,15.66 32.01,16.91 IC31.4
VCC1  (via drill 0.3 pad 0.61)
  Top 0.406: 19.68,4.24 19.16,3.71 16.23,3.71 15.84,4.09 v15.84,4.19 | v15.84,4.19 | 19.68,4.24 19.68,3.71 21.31,2.08 21.31,2.03 JP1.1 | R2.2 19.68,4.24
  Bottom 0.406: 17.78,4.19 17.78,4.9 19.05,6.17 | 17.78,4.19 17.78,3.83 IC2.3 | v15.84,4.19 17.78,4.19 | 19.05,6.17 20.32,6.17 IC2.8 | IC2.7 19.05,6.17
VIN  (via drill 0.3 pad 0.61)
  Top 0.406: v15.67,9.72 15.67,9.34 17.24,7.78 23.34,7.78 OPT2.2 28,7.04 38.22,7.04 38.84,6.43 40.32,6.43 41.38,5.37 41.38,4.59 42.25,3.71 42.55,3.71 SV1.1 | 10.04,11.25 10.98,11.25 J1.2-3 | X1.1 10.04,11.25 | 10.04,11.25 10.04,7.45 J1.2-7 | F1.2 16.44,27.94 16.44,27.85 13.99,25.39 13.36,25.39 12.26,24.28 | J1.1-7 12.26,21.42 12.26,24.28 | 12.26,24.28 J1.1-3
  Bottom 0.406: 13.99,11.42 J1.2-3 | J1.1-7 11.15,16.99 14.8,13.34 14.8,12.23 13.99,11.42 | 13.99,11.42 15.67,9.74 v15.67,9.72
VIN-FUSED  (via drill 0.3 pad 0.61)
  Top 0.406: v19.05,27.77 19.22,27.94 F1.1 R1.1
  Bottom 0.406: IC3.3 16.94,26.08 17.36,26.08 v19.05,27.77
(copper drawn outside any net)
  shapes: Top area x2

### Text on the board
tNames: D4 | D7 | D8 | D9 | MysX2.6 | FUSE | R1 | RESET | GND | RS485 | B | R4 | A | VIN | RX-SEL | TX-SEL | C10 | C32 | D8 | RX | D9 | TX | MiniRS485_RJ45 V1 | StepDown | R3 | R2 | V-EEPROM | VCC | GND | SCL | SDA
bNames: LOOP-A | LOOP-B | C31 | R34 | REG 1117 | ATSHA | C5 | C14 | CRYSTAL | R6 | ATMEGA 328 | R5 | C15 | R7 | EEPROM | VCC | GND | A5 | A4
tDocu: 1 Vraw (typically unregulated voltage, either from motherboard to daughterboard or vice versa) Motherboard should have a jumper to cut onboard Vraw source if daughterboard provides Vraw. Be sure to check motherboard constraints on Vraw before connecting a daughterboard that provides Vraw (for over voltage protection). Should be able to source at least 100mA and all boards are recommended to support a voltage up to 24V on this pin. / 2 +3.3V fixed voltage (can source at least 100mA) / 3 VCCio (depending on MCU core voltage). Should not be used for heavy loads. / 4 GND / 5 MYSX_D1_DFM - Digital IO (USART TX (data from MCU)) / 6 MYSX_D2_DTM - Digital IO (USART RX (data to MCU)) / 7 MYSX_RST - Reset (On the board that carries the MCU, it is highly recommended that this pin has a 0.1uF capacitor in series for pulse “generation”) / 8 MYSX_LEGACY_ID – MYSX 1.x identification (2.0 daughterboards can tie this pin to VCC to allow the motherboard to determine if daughterboard is 1.x or 2.x. If identification is not needed or is undesired, pin can be used as regular analog input) / 9 MYSX_D3_INT - Digital IO (interrupt) / 10 MYSX_D4_INT - Digital IO (interrupt) / 11 MYSX_D5_PWM - Digital IO (PWM) / 12 MYSX_D6_PWM - Digital IO (PWM) / 13 MYSX_D7_SCL - Digital IO (I2C SCL) / 14 MYSX_D8_SDA - Digital IO (I2C SDA) / 15 MYSX_D9_A3 - Digital IO (analog input) / 16 MYSX_D10_A4 - Digital IO (analog input) / 17 MYSX_D11_MOSI - Digital IO (SPI MOSI) / 18 MYSX_D12_MISO - Digital IO (SPI MISO) / 19 MYSX_D13_SCK - Digital IO (SPI SCK) / 20 MYSX_D14_CS - Digital IO (also for SPI CS) / 21 MYSX_A5 - Analog input / 22 MYSX_A6 - Analog input
Name: A1 | A2 | I2C-CON